# EAGLE design MysensorsDimmer (EAGLE 6.5.0)
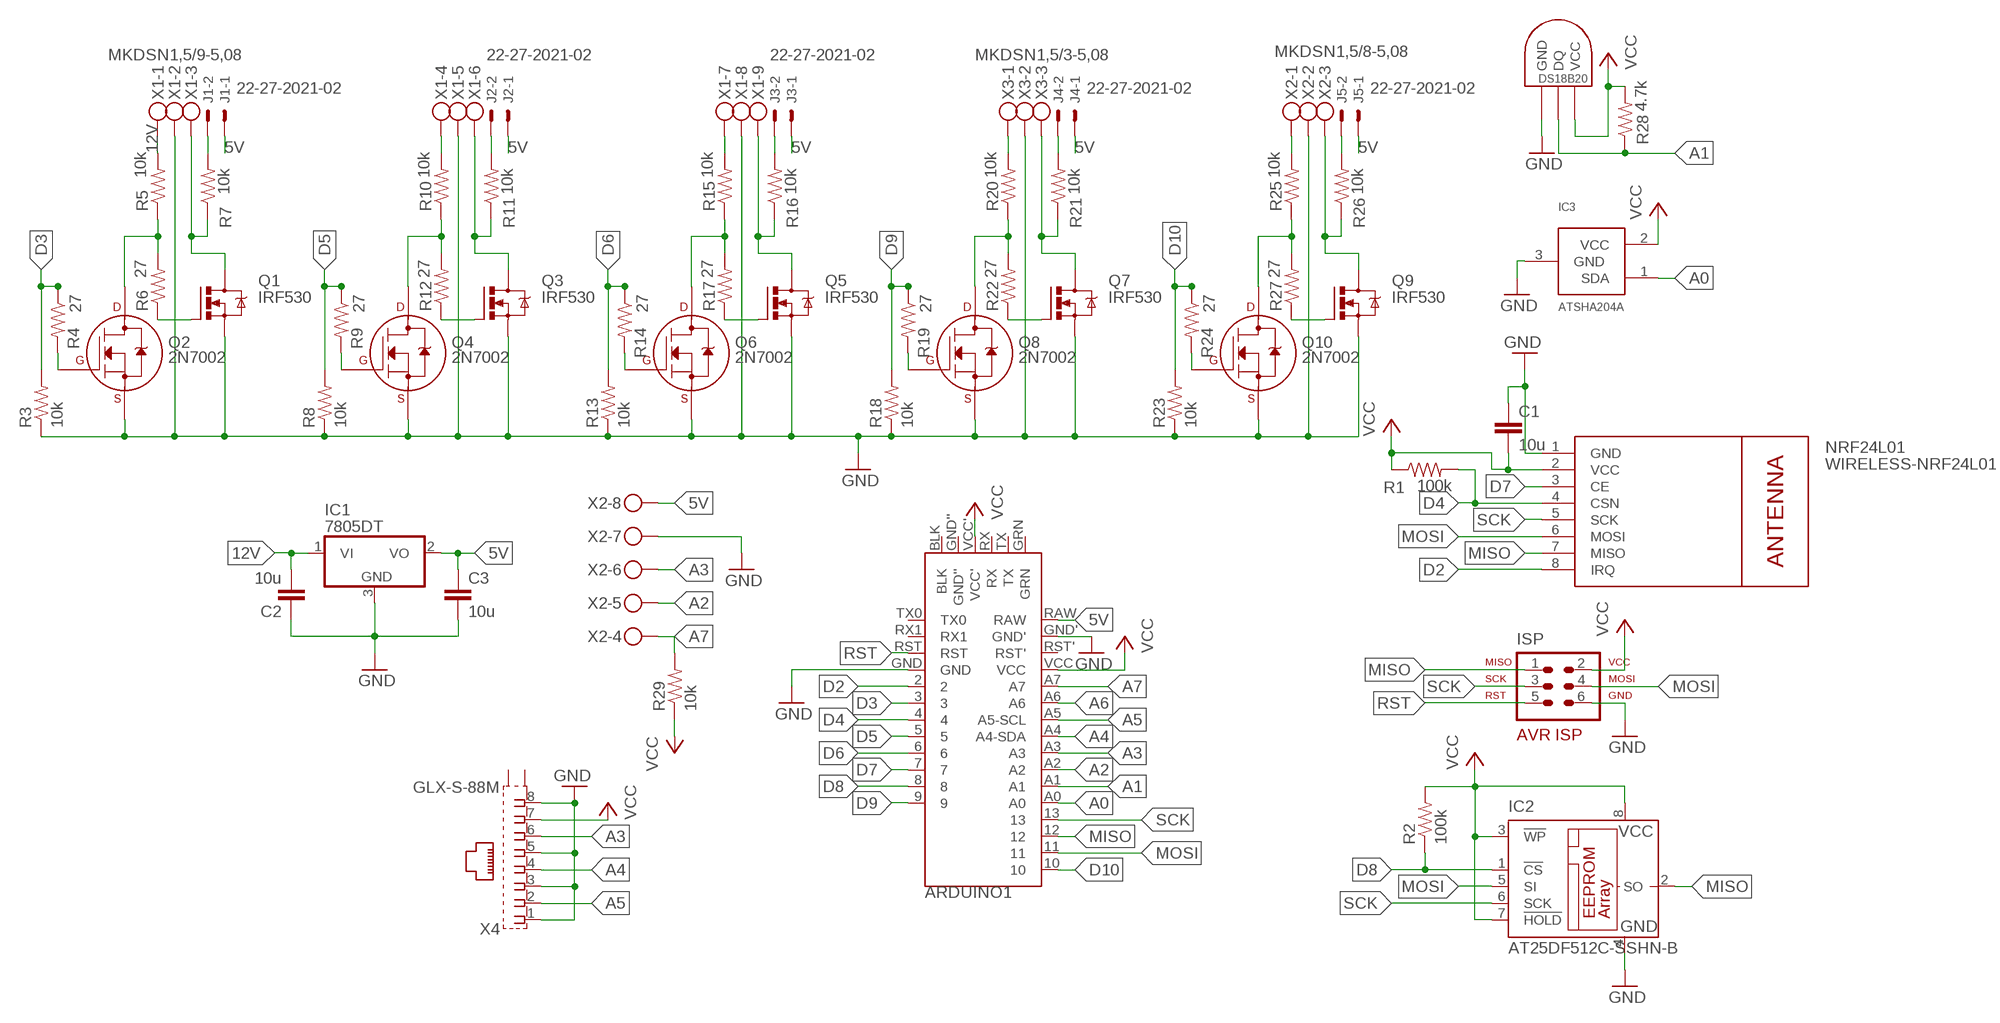
[diagram p0: schematic, sheet 1]

## Parts
ARDUINO1  ARDUINO_PRO_MINI_V1  [ARDUINO_PRO_MINI_V1]
C1  10u  CAP0603-CAP  [0603-CAP]
C2  10u  CAP1206  [1206]
C3  10u  CAP0603-CAP  [0603-CAP]
IC1  7805DT  [TO252]
IC2  AT25DF512C-SSHN-B  25AA080SN  [SO-08]
IC3  ATSHA204A  [SOT23]
IC4  DS1820  [µSOP8]
ISP  N/M  AVR-ISP-6VERT  [AVR-ISP-6]
J1  22-27-2021-02  [6410-02]
J2  22-27-2021-02  [6410-02]
J3  22-27-2021-02  [6410-02]
J4  22-27-2021-02  [6410-02]
J5  22-27-2021-02  [6410-02]
NRF24L01  WIRELESS-NRF24L01  [WIRELESS-NRF24L01]
Q1  IRF530  [TO220BV]
Q2  2N7002  2N7002_SOT23  [SOT-23]
Q3  IRF530  [TO220BV]
Q4  2N7002  2N7002_SOT23  [SOT-23]
Q5  IRF530  [TO220BV]
Q6  2N7002  2N7002_SOT23  [SOT-23]
Q7  IRF530  [TO220BV]
Q8  2N7002  2N7002_SOT23  [SOT-23]
Q9  IRF530  [TO220BV]
Q10  2N7002  2N7002_SOT23  [SOT-23]
R1  100k  RESISTOR0603-RES  [0603-RES]
R2  100k  RESISTOR0603-RES  [0603-RES]
R3  10k  RESISTOR0603-RES  [0603-RES]
R4  27  RESISTOR0603-RES  [0603-RES]
R5  10k  RESISTOR0603-RES  [0603-RES]
R6  27  RESISTOR0603-RES  [0603-RES]
R7  10k  RESISTOR0603-RES  [0603-RES]
R8  10k  RESISTOR0603-RES  [0603-RES]
R9  27  RESISTOR0603-RES  [0603-RES]
R10  10k  RESISTOR0603-RES  [0603-RES]
R11  10k  RESISTOR0603-RES  [0603-RES]
R12  27  RESISTOR0603-RES  [0603-RES]
R13  10k  RESISTOR0603-RES  [0603-RES]
R14  27  RESISTOR0603-RES  [0603-RES]
R15  10k  RESISTOR0603-RES  [0603-RES]
R16  10k  RESISTOR0603-RES  [0603-RES]
R17  27  RESISTOR0603-RES  [0603-RES]
R18  10k  RESISTOR0603-RES  [0603-RES]
R19  27  RESISTOR0603-RES  [0603-RES]
R20  10k  RESISTOR0603-RES  [0603-RES]
R21  10k  RESISTOR0603-RES  [0603-RES]
R22  27  RESISTOR0603-RES  [0603-RES]
R23  10k  RESISTOR0603-RES  [0603-RES]
R24  27  RESISTOR0603-RES  [0603-RES]
R25  10k  RESISTOR0603-RES  [0603-RES]
R26  10k  RESISTOR0603-RES  [0603-RES]
R27  27  RESISTOR0603-RES  [0603-RES]
R28  4.7k  RESISTOR0603-RES  [0603-RES]
R29  10k  RESISTOR0603-RES  [0603-RES]
X1  MKDSN1,5/9-5,08  [MKDSN1,5/9-5,08]
X2  MKDSN1,5/8-5,08  [MKDSN1,5/8-5,08]
X3  MKDSN1,5/3-5,08  [MKDSN1,5/3-5,08]
X4  GLX-S-88M  [GLX-S-88M]

## Nets
5V [Power]: ARDUINO1.RAW C3.1 IC1.2(VO) J1.1 J2.1 J3.1 J4.1 J5.1 X2.8
12V [Power]: C2.2 IC1.1(VI) R5.2 X1.1
A0: ARDUINO1.A0 IC3.1(SDA)
A1: ARDUINO1.A1 IC4.1(DQ) R28.1
A2: ARDUINO1.A2 X2.5
A3: ARDUINO1.A3 X2.6 X4.6
A4: ARDUINO1.A4(A4-SDA) X4.4
A5: ARDUINO1.A5(A5-SCL) X4.2
A6: ARDUINO1.A6
A7: ARDUINO1.A7 R29.2 X2.4
D2: ARDUINO1.2 NRF24L01.8(IRQ)
D3: ARDUINO1.3 R3.2 R4.1
D4: ARDUINO1.4 NRF24L01.4(CSN) R1.2
D5: ARDUINO1.5 R8.2 R9.1
D6: ARDUINO1.6 R13.2 R14.1
D7: ARDUINO1.7 NRF24L01.3(CE)
D8: ARDUINO1.8 IC2.1(!CS) R2.1
D9: ARDUINO1.9 R18.2 R19.1
D10: ARDUINO1.10 R23.2 R24.1
GND [Power]: ARDUINO1.GND ARDUINO1.GND' C1.1 C2.1 C3.2 IC1.3(GND) IC2.4(GND) IC3.3(GND) IC4.4(GND) ISP.6 NRF24L01.1(GND) Q1.S Q2.2(S) Q3.S Q4.2(S) Q5.S Q6.2(S) Q7.S Q8.2(S) Q9.S Q10.2(S) R3.1 R8.1 R13.1 R18.1 R23.1 X1.2 X1.5 X1.8 X2.2 X2.7 X3.2 X4.1 X4.3 X4.5 X4.8
MISO: ARDUINO1.12 IC2.2(SO) ISP.1 NRF24L01.7(MISO)
MOSI: ARDUINO1.11 IC2.5(SI) ISP.4 NRF24L01.6(MOSI)
N$1 [led power]: Q3.D R11.1 X1.6
N$2 [Power]: Q1.G R6.1
N$3: Q4.1(G) R9.2
N$4: Q4.3(D) R10.1 R12.2
N$5: Q2.1(G) R4.2
N$6 [Power]: Q3.G R12.1
N$7: J2.2 R11.2
N$8: Q2.3(D) R5.1 R6.2
N$9: J1.2 R7.2
N$10 [led power]: Q5.D R16.1 X1.9
N$11: Q6.1(G) R14.2
N$12: Q6.3(D) R15.1 R17.2
N$13 [Power]: Q5.G R17.1
N$14: J3.2 R16.2
N$15 [led power]: Q7.D R21.1 X3.3
N$16: Q8.1(G) R19.2
N$17: Q8.3(D) R20.1 R22.2
N$18 [Power]: Q7.G R22.1
N$19: J4.2 R21.2
N$20 [led power]: Q9.D R26.1 X2.3
N$21: Q10.1(G) R24.2
N$22 [led power]: Q1.D R7.1 X1.3
N$23: Q10.3(D) R25.1 R27.2
N$24 [Power]: Q9.G R27.1
N$25: J5.2 R26.2
N$26: R10.2 X1.4
N$27: R15.2 X1.7
N$28: R20.2 X3.1
N$29: R25.2 X2.1
RST: ARDUINO1.RST ISP.5
SCK: ARDUINO1.13 IC2.6(SCK) ISP.3 NRF24L01.5(SCK)
VCC [Power]: ARDUINO1.VCC ARDUINO1.VCC' C1.2 IC2.3(!WP) IC2.7(!HOLD) IC2.8(VCC) IC3.2(VCC) IC4.8(VCC) ISP.2 NRF24L01.2(VCC) R1.1 R2.2 R28.2 R29.1 X4.7
Unconnected: ARDUINO1.BLK ARDUINO1.GND'' ARDUINO1.GRN ARDUINO1.RST' ARDUINO1.RX ARDUINO1.RX1 ARDUINO1.TX ARDUINO1.TX0 X4.S1 X4.S2

## Library data of the parts
ARDUINO1 = Arduino_Pro_Mini:ARDUINO_PRO_MINI_V1
C1-C3 = SparkFun-Passives:CAP: Capacitor Standard 0603 ceramic capacitor, and 0.1" leaded capacitor.
IC1 = linear:78*: Positive VOLTAGE REGULATOR Source: http://cache.national.com/ds/LM/LM78L05.pdf http://www.fairchildsemi.com/ds/LM/LM7805.pdf
IC2 = microchip:25*: Serial EEPROM 4K/ 8K , SPI bus; MF: MICROCHIP; MPN: 25AA080/SN; OC_FARNELL: 1816072; OC_NEWARK: 92C7351
IC3 = Sensor:ATSHA204A
IC4 = Ava:DS1820: DS18B20 Programmable Resolution 1-Wire Digital Thermometer Description The DS18B20 digital thermometer provides 9-bit to 12-bit Celsius temperature measurements and has an alarm function with nonvolatile user-programmable upper and lower trigger points. The DS18B20 communicates over a 1-Wire® bus that by definition requires only one data line (and ground) for communication with a central microprocessor. It has an operating temperature range of -55°C to +125°C and is accurate to ±0.5°C over the range of -10°C to +85°C. In addition, the DS18B20 can derive power directly from the data line ("parasite power"), eliminating the need for an external power supply. Each DS18B20 has a unique 64-bit serial code, which allows multiple DS18B20s to function on the same 1-Wire bus. Thus, it is simple to use one microprocessor to control many DS18B20s distributed over a large area. Applications that can benefit from this feature include HVAC environmental controls, temperature monitoring systems inside buildings, equipment, or machinery, and process monitoring and control systems.
ISP = avr-7:AVR-ISP-6: AVR ISP-6 Serial Programming Header
J1-J5 = con-molex:22-?-02: CONNECTOR wire to board 2.54 mm (.1 inch) pitch header; OC_FARNELL: unknown; OC_NEWARK: unknown
NRF24L01 = diy-modules:WIRELESS-NRF24L01: 2.4 GHz Wireless Module based on NRF24L01 chip More details available here: http://www.electrodragon.com/w/NRF24L01 Click here to find device on ebay.com <http://www.ebay.com/sch/nrf24l01+arduino>
Q1 Q3 Q5 Q7 Q9 = transistor-power:IRF530: HEXFET Power MOSFET
Q2 Q4 Q6 Q8 Q10 = transistors:2N700*: 2N7000, 2N7002, NDS7002A N-channel enhancement mode MOSFET
R1-R29 = SparkFun-Passives:RESISTOR: Resistor Basic schematic elements and footprints for 0603, 1206, and PTH resistors.
X1 = con-phoenix-508:MKDSN1,5/9-5,08: MKDSN 1,5/ 9-5,08 Printklemme Nennstrom: 13,5 A Nennspannung: 250 V Rastermaß: 5,08 mm Polzahl: 9 Anschlussart: Schraubanschluss Montage: Löten Anschlussrichtung Leiter/Platine: 0 ° Artikelnummer: 1729199 Source: http://eshop.phoenixcontact.com .. 1729199.pdf; MPN: SMKDSN1,5/9-5,08; OC_FARNELL: 1792912; OC_NEWARK: 70R0305
X2 = con-phoenix-508:MKDSN1,5/8-5,08: MKDSN 1,5/ 8-5,08 Printklemme Nennstrom: 13,5 A Nennspannung: 250 V Rastermaß: 5,08 mm Polzahl: 8 Anschlussart: Schraubanschluss Montage: Löten Anschlussrichtung Leiter/Platine: 0 ° Artikelnummer: 1729186 Source: http://eshop.phoenixcontact.com .. 1729186.pdf; MPN: SMKDSN1,5/8-5,08; OC_FARNELL: 1792911; OC_NEWARK: 70R0304
X3 = con-phoenix-508:MKDSN1,5/3-5,08: MKDSN 1,5/ 3-5,08 Printklemme Nennstrom: 13,5 A Nennspannung: 250 V Rastermaß: 5,08 mm Polzahl: 3 Anschlussart: Schraubanschluss Montage: Löten Anschlussrichtung Leiter/Platine: 0 ° Artikelnummer: 1729131 Source: http://eshop.phoenixcontact.com .. 1729131.pdf; MPN: SMKDSN1,5/3-5,08; OC_FARNELL: 1792904; OC_NEWARK: 70R0299
X4 = con-kycon:GLX-S-88M: Mod. Jack, Right Angle, 8 posiotion, 8 contatcs RJ45 Source: GLX-S-88M.pdf; OC_FARNELL: unknown; OC_NEWARK: unknown

## Net classes
0 default: width 0.203 mm, drill 0.406 mm, clearance 0.203 mm
1 Power: width 0.406 mm, drill 0.406 mm, clearance 0.203 mm
2 led power: width 1.524 mm, drill 0.406 mm, clearance 0.203 mm

## Board
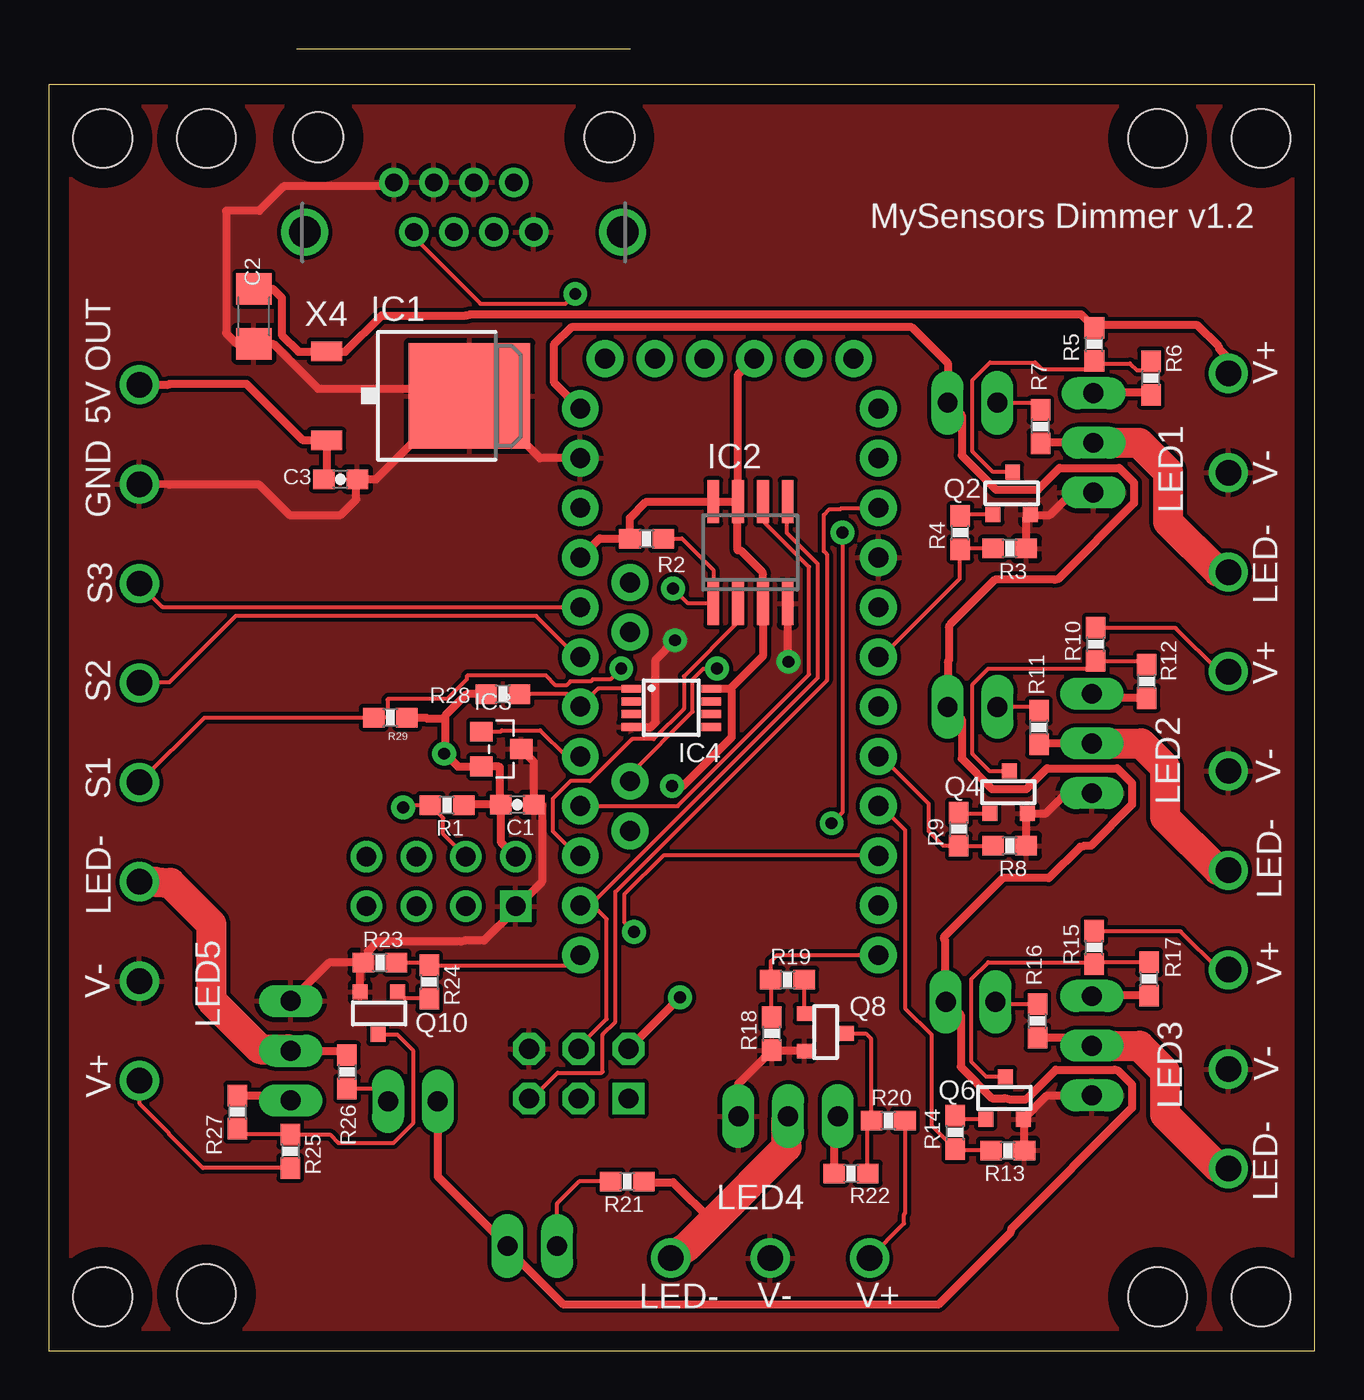
[diagram p1: board, top side]
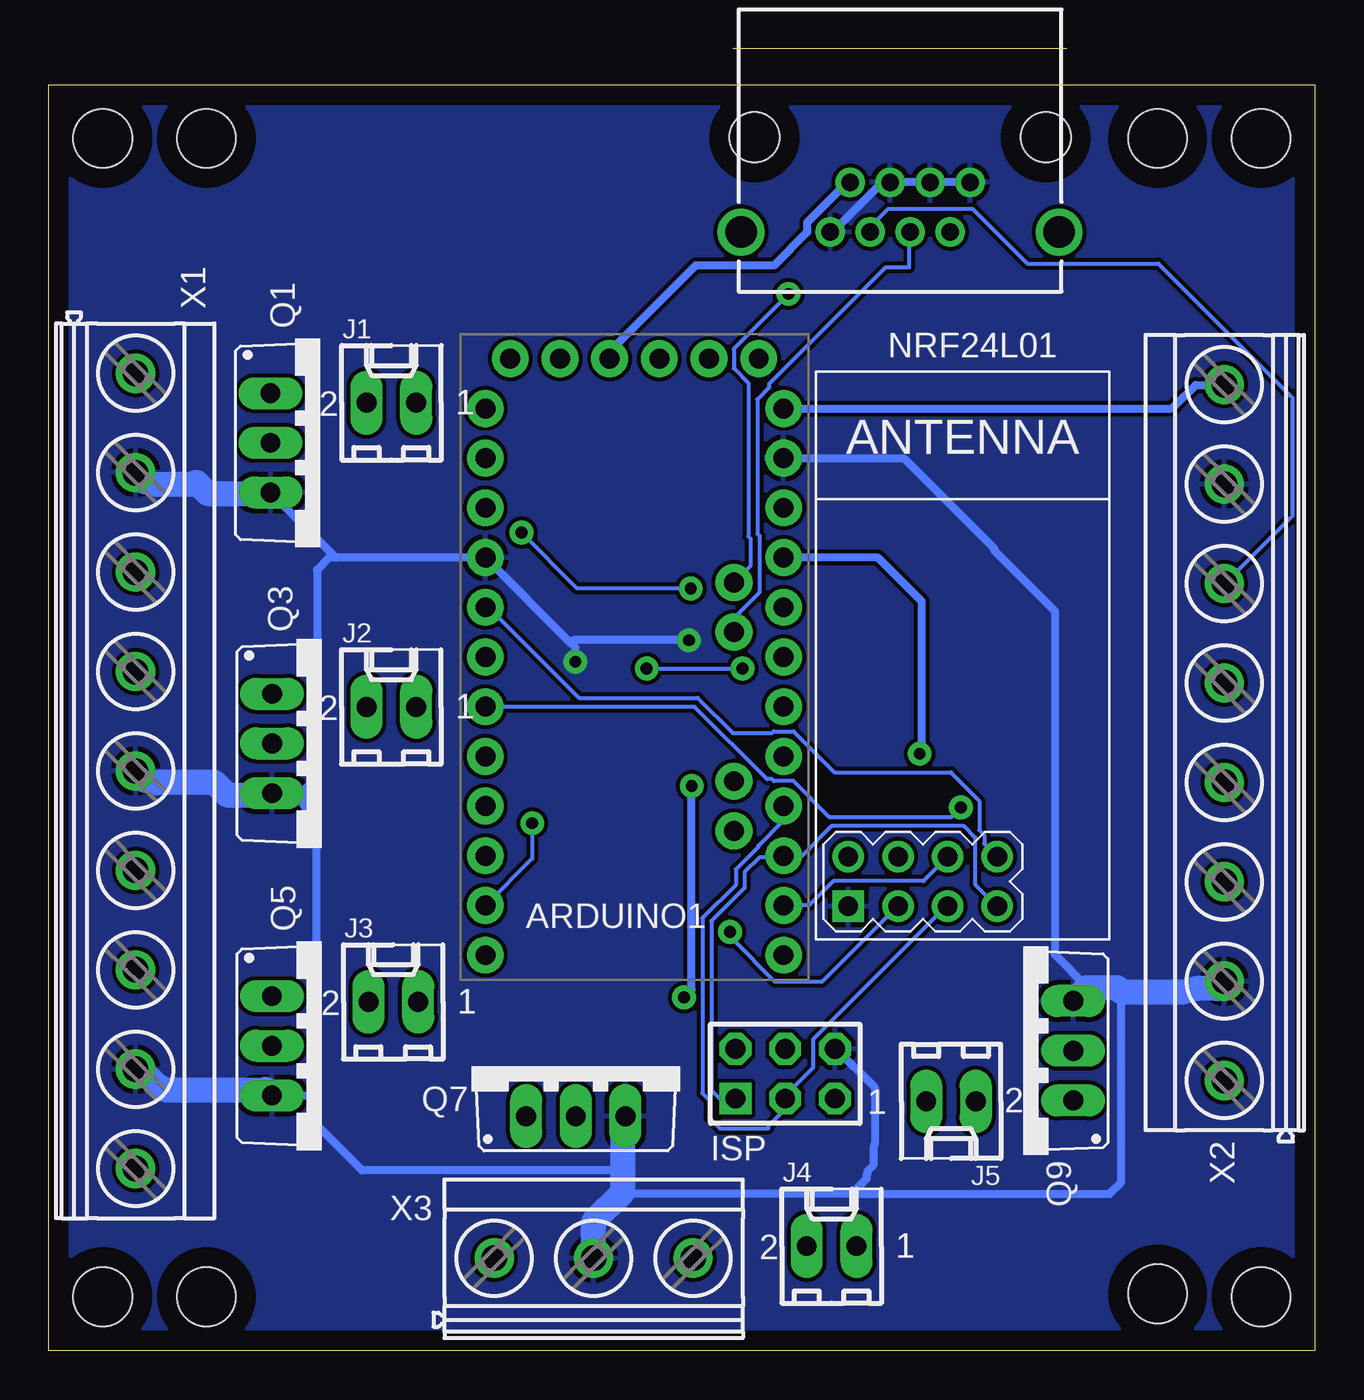
[diagram p2: board, bottom side, seen from below]

Size 64.7 x 64.7 mm. Coordinates in mm from the lower left corner, seen from the top.
Outline: 0,0 64.7,0 64.7,64.7 0,64.7 0,0
Copper layers (1*16): Top 0.035mm / dielectric 1.5mm / Bottom 0.035mm
Design rules "default *": minimum track width 8mil, minimum drill 24mil, track to track 8mil, track to pad 8mil, pad to pad 8mil, via to via 8mil, smd to smd 8mil, copper to edge 40mil, drill to drill 8mil, minimum pad ring 12mil, minimum via ring 12mil, stop-mask expansion 4mil, vias tented up to drill 0mil, thermal gap 10mil
Holes 3 mm at 2.75,2.75 61.95,2.75 2.75,61.95 61.95,61.95 8.05,61.95 8.05,2.9 56.65,2.75 56.65,61.95

### Footprints (pad centres in the part's own frame; a part is rotated, then mirrored left to right if it is on the bottom)
ARDUINO_PRO_MINI_V1 = drill 1.016 pad 1.88: 2 -7.62,2.54; 3 -7.62,0; 4 -7.62,-2.54; 5 -7.62,-5.08; 6 -7.62,-7.62; 7 -7.62,-10.16; 8 -7.62,-12.7; 9 -7.62,-15.24; 10 7.62,-15.24; 11 7.62,-12.7; 12 7.62,-10.16; 13 7.62,-7.62; A0 7.62,-5.08; A1 7.62,-2.54; A2 7.62,0; A3 7.62,2.54; A4 5.08,1.27; A5 5.08,3.81; A6 5.08,-8.89; A7 5.08,-6.35; BLK -6.35,15.24; GND -7.62,5.08; GND' 7.62,10.16; GND'' -3.81,15.24; GRN 6.35,15.24; RAW 7.62,12.7; RST -7.62,7.62; RST' 7.62,7.62; RX 1.27,15.24; RX1 -7.62,10.16; TX 3.81,15.24; TX0 -7.62,12.7; VCC 7.62,5.08; VCC' -1.27,15.24
0603-CAP = smd 1.1 x 1: 1 -0.85,0; 2 0.85,0
1206 = smd 1.6 x 1.8: 1 -1.4,0; 2 1.4,0
TO252 = smd 1 x 1.6: 1 -2.28,-4.8; 2 2.28,-4.8 | smd 5.4 x 6.2: 3 0,2.5
SO-08 = smd 0.6 x 2.2: 1 -1.905,-2.6; 2 -0.635,-2.6; 3 0.635,-2.6; 4 1.905,-2.6; 5 1.905,2.6; 6 0.635,2.6; 7 -0.635,2.6; 8 -1.905,2.6
SOT23 = smd 1.016 x 1.143: 1 -0.889,-1.016; 2 0.889,-1.016; 3 0,1.016
µSOP8 = smd 0.4 x 1: 1 -0.975,-2.05; 2 -0.325,-2.05; 3 0.325,-2.05; 4 0.975,-2.05; 5 0.975,2.05; 6 0.325,2.05; 7 -0.325,2.05; 8 -0.975,2.05
AVR-ISP-6 = drill 1.016 square: 1 -2.54,-1.27 | drill 1.016 octagon: 2 -2.54,1.27; 3 0,-1.27; 4 0,1.27; 5 2.54,-1.27; 6 2.54,1.27
6410-02 = drill 1.016 long: 1 1.27,0; 2 -1.27,0
WIRELESS-NRF24L01 = drill 1 square: 1 -12.7,6.35 | drill 1: 2 -10.16,6.35; 3 -12.7,3.81; 4 -10.16,3.81; 5 -12.7,1.27; 6 -10.16,1.27; 7 -12.7,-1.27; 8 -10.16,-1.27
TO220BV = drill 1.016 long: D 0,-2.54; G -2.54,-2.54; S 2.54,-2.54
SOT-23 = smd 0.762 x 0.762: 1 -0.979,-1.101; 2 0.94,-1.101; 3 0.025,1.067
0603-RES = smd 1.1 x 1: 1 -0.85,0; 2 0.85,0
MKDSN1,5/9-5,08 = drill 1.3 pad 2: 1 -20.341,0.025; 2 -15.261,0.025; 3 -10.181,0.025; 4 -5.101,0.025; 5 -0.021,0.025; 6 5.059,0.025; 7 10.139,0.025; 8 15.219,0.025; 9 20.299,0.025
MKDSN1,5/8-5,08 = drill 1.3 pad 2: 1 -17.801,0.025; 2 -12.721,0.025; 3 -7.641,0.025; 4 -2.561,0.025; 5 2.519,0.025; 6 7.599,0.025; 7 12.679,0.025; 8 17.759,0.025
MKDSN1,5/3-5,08 = drill 1.3 pad 2: 1 -7.641,0.025; 2 -2.561,0.025; 3 2.519,0.025
GLX-S-88M = drill 0.9 pad 1.422: 1 -3.57,-2.3; 2 -2.55,-4.84; 3 -1.53,-2.3; 4 -0.51,-4.84; 5 0.51,-2.3; 6 1.53,-4.84; 7 2.55,-2.3; 8 3.57,-4.84 | drill 1.6 pad 2.184: S1 -8.125,-4.84; S2 8.125,-4.84 | hole 2.55: -7.44,0; 7.44,0

### Placement (x,y rotation side)
ARDUINO1  34.77,35.45 0 bottom
C1  23.94,27.9 180 top
C2  10.47,52.85 90 top
C3  14.9,44.53 0 top
IC1  18.99,48.79 270 top
IC2  35.85,40.79 0 top
IC3  23.12,30.74 270 top
IC4  31.8,32.85 270 top
ISP  27.07,14.15 0 bottom
J1  47.2,48.44 0 bottom
J2  47.2,32.9 0 bottom
J3  47.1,17.82 0 bottom
J4  24.7,5.34 0 bottom
J5  18.6,12.74 180 bottom
NRF24L01  17.5,35.4 90 bottom
Q1  50.84,46.39 270 bottom
Q2  49.22,43.82 0 top
Q3  50.76,31.03 270 bottom
Q4  49.06,28.55 0 top
Q5  50.76,15.57 270 bottom
Q6  48.86,12.92 0 top
Q7  37.77,14.52 0 bottom
Q8  39.7,16.24 270 top
Q9  14.89,15.33 90 bottom
Q10  16.84,17.22 180 top
R1  20.35,27.87 180 top
R2  30.55,41.49 180 top
R3  49.1,40.99 180 top
R4  46.57,41.8 90 top
R5  53.43,51.42 90 top
R6  56.32,49.7 90 top
R7  50.67,47.22 90 top
R8  49.1,25.8 180 top
R9  46.5,26.65 90 top
R10  53.5,36.1 90 top
R11  50.6,31.84 90 top
R12  56.1,34.19 90 top
R13  49,10.22 180 top
R14  46.32,11.15 90 top
R15  53.42,20.6 90 top
R16  50.52,16.84 90 top
R17  56.22,18.99 90 top
R18  36.94,16.2 90 top
R19  37.75,18.96 0 top
R20  42.9,11.76 0 top
R21  29.56,8.64 180 top
R22  40.99,9.06 0 top
R23  16.92,19.83 0 top
R24  19.43,18.84 270 top
R25  12.33,10.19 270 top
R26  15.23,14.24 270 top
R27  9.63,12.19 270 top
R28  23.2,33.55 180 top
R29  17.45,32.35 180 top
X1  60.3,29.6 270 bottom
X2  4.6,31.6 90 bottom
X3  34.3,4.7 0 bottom
X4  21.2,62 0 top

### Tracks (layer width: path | path; a pad name or v marks a point on that pad's centre or on a via)
5V
  Top 0.406: C3.1 14.19,44.67 IC1.2 12.99,46.51 10.1,49.4 6.17,49.4 6,49.35 4.65,49.35 X2.8 | ARDUINO1.RAW 25.8,49.5 25.8,51.4 26.7,52.3 44.1,52.3 45.93,50.47 J1.1 46.1,48.35 46.65,47.8 46.65,45.75 48.4,44 50.55,44 51.65,45.1 54.7,45.1 55.45,44.35 55.45,43.3 51.6,39.45 51.4,39.4 48.35,39.4 46.05,37.1 46,36.9 46,35.3 45.95,35.1 45.95,33.05 J2.1 46.1,32.8 46.65,32.25 46.65,30.25 48.2,28.7 49.95,28.7 51,29.75 54.6,29.75 55.35,29 55.35,27.9 53.25,25.8 52.9,25.8 52.7,25.75 51.1,24.15 48.75,24.15 45.75,21.15 45.8,20.95 45.8,18 J3.1 46,17.75 46.6,17.15 46.6,14.5 48.2,12.9 48.85,12.9 49.05,12.85 49.95,12.85 51.45,14.35 54.45,14.35 54.65,14.3 55.35,13.6 55.35,12.4 49.2,6.25 49.15,6.05 45.45,2.35 26.3,2.35 23.5,5.15 J4.1 19.87,8.9 J5.1
  Bottom 0.406: ARDUINO1.RAW 7.31,48.15 7.31,48.18 7.15,48.3 6.1,49.35 4.65,49.35 X2.8
12V
  Top 0.406: X1.1 60.25,49.95 60.25,50.75 59.85,51.15 59.77,51.33 58.7,52.4 53.55,52.4 R5.2 52.75,52.95 21.5,52.95 21.3,52.9 17,52.9 15.15,51.05 14.4,51.05 IC1.1 14.15,51.05 12.75,51.05 11.9,51.9 11.9,53.8 11.45,54.25 10.5,54.25 C2.2
A0
  Top 0.203: ARDUINO1.A0 27.15,30.4 26.4,30.4 25.1,31.7 23.15,31.7 23.1,31.65 22.15,31.65 IC3.1
A1
  Top 0.203: IC4.1 28.07,33.83 ARDUINO1.A1 27.1,32.95 26.5,33.55 R28.1
A2
  Top 0.203: ARDUINO1.A2 27,35.45 24.9,37.55 9.55,37.55 6.15,34.15 4.65,34.15 X2.5
A3
  Top 0.203: ARDUINO1.A3 5.8,38 4.65,39.15 X2.6
  Bottom 0.203: X2.6 4.6,39.2 1.15,42.65 1.15,48.7 8,55.55 14.7,55.55 17.5,58.35 21.8,58.35 22.7,57.45 22.7,57.2 X4.6
A4
  Bottom 0.203: ARDUINO1.A4 29.65,36.75 29.65,37.5 28.4,38.75 28.4,41.65 28.5,41.75 28.5,48.6 27.9,49.2 27.9,49.4 21.95,55.35 20.75,55.35 20.75,57.1 X4.4
A5  (via drill 0.61)
  Top 0.203: v26.9,54 26.4,53.5 22.05,53.5 18.65,56.9 X4.2
  Bottom 0.203: ARDUINO1.A5 28.85,40.1 28.85,41.5 28.95,41.6 28.95,49.45 29.7,50.2 29.7,51.2 v26.9,54
A7  (via drill 0.61)
  Top 0.203: X2.4 4.65,29.05 7.95,32.35 R29.2 17.3,32.35 17.3,33.25 17.35,33.3 20.35,33.3 21.35,34.3 21.35,34.45 21.4,34.5 25.4,34.5 25.9,34 26.45,34 26.65,34.2 27.7,34.2 27.8,34.3 28.7,34.3 v29.25,34.85 | v34.15,34.85 33.45,34.85 32.9,34.3 32.9,32.65 29.7,29.45 ARDUINO1.A7
  Bottom 0.203: v34.15,34.85 v29.25,34.85
D2
  Bottom 0.203: NRF24L01.8 16.25,25.25 16.9,25.9 16.9,26.35 17.15,26.6 17.15,28.1 18.6,29.55 24.55,29.55 26.65,31.65 27.65,31.65 27.75,31.55 29.75,31.55 31.55,33.35 37.6,33.35 42.2,37.95 42.35,37.95 ARDUINO1.2
D3
  Top 0.203: R3.2 46.61,40.99 | R4.1 46.55,40.85 46.55,39.45 42.55,35.45 ARDUINO1.3
  Top 0.254: 46.61,40.99 R4.1
D4  (via drill 0.61)
  Top 0.203: NRF24L01.4 20.15,26.4 20.15,27.22 R1.2 19.4,27.85 18.5,27.85 18.4,27.75 v18.1,27.75
  Bottom 0.203: v18.1,27.75 18.6,27.25 24.8,27.25 26.65,29.1 27.65,29.1 27.75,29.2 28,29.2 31.7,32.9 42.35,32.9 ARDUINO1.4
D5
  Top 0.203: ARDUINO1.5 42.4,30.35 42.55,30.35 44.95,27.95 44.95,26.55 45.7,25.8 R9.1 46.6,25.8 R8.2
D6
  Top 0.203: R13.2 46.4,10.22 R14.1 46.3,10.3 45.1,11.5 45.1,16.15 43.75,17.5 43.75,26.6 42.55,27.8 42.4,27.8 ARDUINO1.6
D7  (via drill 0.61)
  Top 0.203: ARDUINO1.7 42.35,25.3 31.4,25.3 29.4,23.3 29.4,21.9 v29.9,21.4
  Bottom 0.203: NRF24L01.3 21.35,22.7 25.2,18.85 27.6,18.85 29.75,21 29.75,21.35 29.85,21.35 v29.9,21.4
D8  (via drill 0.61)
  Top 0.203: R2.1 32.35,41.5 33.95,39.9 IC2.1 32.66,38.19 v31.9,38.95 | v40.55,41.8 40.55,27.5 v40,26.95
  Bottom 0.203: v31.9,38.95 37.7,38.95 v40.55,41.8 | v40,26.95 40,25.14 ARDUINO1.8
D9
  Top 0.203: ARDUINO1.9 42.35,20.2 37.2,20.2 36.9,19.9 R19.1 36.9,17.1 R18.2
D10
  Top 0.203: R23.2 19.29,19.83 R24.1 26.63,19.69 ARDUINO1.10
GND  (via drill 0.61)
  Top 0.406: 20.9,49.22 20.7,49.22 20.5,49.02 20.5,48.3 16.73,44.53 C3.2 15.7,44.48 15.7,43.5 14.9,42.7 12.3,42.7 10.74,44.26 6.15,44.26 X2.7 | 20.9,49.22 21.06,49.22 IC1.3 21.88,48.4 22.3,48.4 25.09,45.61 ARDUINO1.GND' | R13.1 49.85,11.77 Q6.2 51.01,13.03 Q5.S | Q8.2 38.55,15.35 R18.1 35.23,13.64 Q7.S | Q10.2 15.9,19.67 R23.1 | R23.1 14.32,19.83 Q9.S | IC3.3 24.79,30.08 C1.1 24.95,27.9 25.2,27.9 25.2,23.95 23.95,22.7 NRF24L01.1 23.8,22.65 23.8,22.5 22.25,20.95 21.25,20.95 21.05,20.9 16.8,20.9 16.3,20.4 16.3,20.07 R23.1 | IC2.4 37.76,35.24 v37.8,35.2 | v32,36.3 31,35.3 31,32.1 30.77,31.88 IC4.4 | Q1.S 52.3,43.85 51.15,42.7 50.2,42.7 Q2.2 49.95,42.51 R3.1 | R8.1 49.95,27.4 Q4.2 50.2,27.45 50.95,27.45 51.95,28.45 53.3,28.45 Q3.S | 20.9,49.22 20.83,49.15 13.75,49.15 11.45,51.45 10.5,51.45 C2.1 10.3,51.45 9.6,51.45 9.05,52 9.05,58.25 10.75,58.25 12,59.5 17.4,59.5 17.6,59.7 X4.1
  Bottom 0.406: 50.06,40.53 ARDUINO1.GND 38.03,36.17 | 50.06,40.53 Q1.S | 50.06,40.53 50.37,40.53 51,39.9 51,29.29 51.8,28.49 | 51.8,28.49 Q3.S | 51.8,28.49 51.7,28.39 51.7,27.9 51.01,27.21 51.01,13.03 51.1,13.03 | Q5.S 51.1,13.03 | Q7.S 35.23,9.37 35.4,9.2 48.7,9.2 51,11.5 51,12.93 51.1,13.03 | 23.7,8 22.9,8.8 22.9,9 22.85,9.2 22.55,9.5 22.55,10.35 22.5,10.55 22.5,13.45 24.5,15.45 ISP.6 | 23.7,8 35.26,8 35.36,8.1 | 23.7,8 10.5,8 9.9,8.6 9.9,18.34 10.1,18.54 | ARDUINO1.GND' 21.01,45.61 16.4,41 16.4,40.9 13.3,37.8 13.3,20.24 11.6,18.54 | v37.8,35.2 37.8,35.93 38.03,36.17 | v32,36.3 37.9,36.3 38.03,36.17 | X4.1 X4.3 X4.5 21.9,59.65 22.15,59.65 24.6,57.2 24.75,57.2 X4.8
  Bottom 1.27: Q1.S 53.43,43.8 56.6,43.8 57.16,44.36 57.26,44.26 59.17,44.26 59.8,44.4 60.25,44.85 X1.2 | Q3.S 53.39,28.4 55.6,28.4 56.22,29.02 59.17,29.02 59.8,29.15 60.25,29.6 X1.5 | 53.63,13.36 53.57,13.3 | Q7.S 35.36,11.85 35.36,8.1 36.86,6.6 X3.2 | 10.1,18.54 11.6,18.54 11.68,18.54 Q9.S | 53.57,13.3 Q5.S | 9.9,18.34 6.67,18.34 6.05,18.5 5,18.5 4.65,18.85 X2.2 | 53.57,13.3 58.69,13.3 59.25,13.6 60,14.35 60.25,14.35 X1.8
  pour Bottom: 0,0 64.7,0 64.7,64.7 0,64.7
  pour Top: 0,0 64.7,0 64.7,64.7 0,64.7
MISO
  Top 0.203: IC2.2 35.2,38.15 35.2,37.2 32.45,34.45 32.45,32.8 30.9,31.25 29.8,31.25 27.65,29.1 26.65,29.1 25.75,28.2 25.75,26.55 27,25.3 ARDUINO1.12
  Bottom 0.203: NRF24L01.7 16.25,22.7 17.35,23.8 17.35,26.2 17.95,26.8 24.7,26.8 26.2,25.3 27.05,25.3 ARDUINO1.12 27.2,25.2 28.4,25.2 29.15,24.45 29.15,23.65 30.85,21.95 30.85,13.3 30.43,12.88 ISP.1
MOSI
  Top 0.203: 27.65,22.75 27.2,22.75 ARDUINO1.11 | 27.65,22.75 39.3,34.4 39.3,40.2 37.7,41.8 37.7,42.35 37.75,42.4 37.75,43.35 IC2.5 | 27.1,15.45 ISP.4 27.1,15.55 28.5,16.95 28.5,22.05 27.8,22.75 27.65,22.75
  Bottom 0.203: ARDUINO1.11 25.85,22.75 24.6,24 20,24 18.8,25.2 NRF24L01.6
N$1
  Top 0.406: Q3.D 50.63,31.03 R11.1
  Top 1.524: Q3.D 55.82,31.03 57.05,29.8 57.05,27.25 59.75,24.55 60.25,24.55 X1.6
N$2
  Top 0.406: Q1.G 53.4,48.95 56.3,48.95 56.35,48.9 R6.1
N$3
  Top 0.203: 46.55,27.45 Q4.1
  Top 0.254: 46.55,27.45 R9.2
N$4
  Top 0.203: Q4.3 49.05,29.6 48.1,29.6 47.2,30.5 47.2,34.05 48,34.85 53.1,34.85 R10.1 55.9,35.25 R12.2
N$5
  Top 0.203: Q2.1 46.64,42.72 R4.2
N$6
  Top 0.406: R12.1 53.52,33.34 Q3.G
N$7
  Top 0.203: R11.2 50.6,32.9 48.5,32.9 J2.2
N$8
  Top 0.203: Q2.3 49.2,44.9 48.25,44.9 47.2,45.95 47.2,49.6 48.1,50.5 50.4,50.5 50.75,50.15 53.45,50.15 53.45,50.55 R5.1 53.55,50.45 55.25,50.45 55.6,50.1 56.3,50.1 56.3,50.55 R6.2
N$9
  Top 0.203: J1.2 50.31,48.44 R7.2
N$10
  Top 0.406: R16.1 52.88,15.99 Q5.D
  Top 1.524: Q5.D 55.73,15.57 57.05,14.25 57.05,12.05 59.75,9.35 60.3,9.3 X1.9
N$11
  Top 0.203: Q6.1 46.5,11.82
  Top 0.254: 46.5,11.82 R14.2
N$12
  Top 0.203: R17.2 53.52,19.84 R15.1 53.32,19.85 48,19.85 47.15,19 47.15,14.75 47.9,14 48.85,14 Q6.3
N$13
  Top 0.406: R17.1 53.33,18.14 Q5.G
N$14
  Top 0.203: R16.2 48.5,17.69 J3.2
N$15
  Top 0.406: 33.9,6.6 31.9,8.6 30.5,8.6 R21.1
  Top 1.524: Q7.D 37.7,11.9 37.7,10.4 33.9,6.6 32.6,5.3 31.95,4.9 31.8,4.75 X3.3
N$16
  Top 0.203: R19.2 Q8.1
N$17
  Top 0.203: Q8.3 40.8,16.2 41.75,16.2 42,15.95 42,11.8 R20.1 | R22.2 41.84,11.55
  Top 0.254: 41.84,11.55 R20.1
N$18
  Top 0.406: R22.1 40.14,11.8 Q7.G
N$19
  Top 0.203: J4.2 25.97,7.52 27.09,8.64 R21.2
N$20
  Top 0.406: Q9.D 15,15.33 R26.1
  Top 1.524: Q9.D 12.2,15.4 10.8,15.4 8.3,17.9 8.3,21.8 6.2,23.9 5.45,23.95 4.65,23.95 X2.3
N$21
  Top 0.203: R24.2 18.16,17.99 Q10.1
N$22
  Top 0.406: Q1.D 50.69,46.39 R7.1
  Top 1.524: Q1.D 53.55,46.4 55.7,46.4 57.2,44.9 57.2,42.35 59.75,39.8 60.3,39.8 X1.3
N$23
  Top 0.203: R27.2 9.94,11.04 R25.1 14.36,11.04 14.8,10.6 17.6,10.6 18.6,11.6 18.6,15.35 17.8,16.15 16.85,16.15 Q10.3
N$24
  Top 0.406: R27.1 12.1,13.04 Q9.G
N$25
  Top 0.203: R26.2 16.68,13.39 J5.2
N$26
  Top 0.203: R10.2 57.53,36.95 57.6,36.9 59.75,34.75 60.25,34.75 X1.4
N$27
  Top 0.203: R15.2 57.79,21.45 57.85,21.4 59.75,19.5 60.25,19.5 X1.7
N$28
  Top 0.203: R20.2 43.75,7.03 43.7,6.95 43.7,6.5 41.95,4.75 X3.1
N$29
  Top 0.203: R25.2 7.86,9.34 6.12,11.07 6.1,11.15 4.65,12.6 4.65,13.75 X2.1
RST
  Top 0.203: ISP.5 24.55,12.9 24.7,12.9 26,14.2 28.25,14.2 28.3,14.25 28.3,16.15 28.95,16.8 28.95,23.45 39.75,34.25 39.75,40.7 39.6,40.85 39.6,42.7 39.9,43 40.45,43 40.5,43.05 42.35,43.05 ARDUINO1.RST
SCK
  Top 0.203: ARDUINO1.13 32.13,27.83 38.85,34.55 38.85,40.05 36.5,42.4 36.5,43.35 IC2.6
  Bottom 0.203: ARDUINO1.13 27.2,27.8 27.2,27.05 28.45,25.8 28.45,25.75 29.6,24.6 29.6,23.8 31.3,22.1 31.3,13.15 30.95,12.8 30.95,11.9 30.4,11.35 27.95,11.35 27.95,11.45 27.1,12.3 27.1,12.85 ISP.3 27.05,12.95 27.05,13.05 25.65,14.45 25.65,15.9 18.85,22.7 NRF24L01.5
VCC  (via drill 0.61)
  Top 0.406: IC2.7 IC2.8 33.75,43.35 30.5,43.35 29.7,42.55 R2.2 29.5,41.5 28.15,41.5 27.2,40.55 ARDUINO1.VCC | IC2.7 35.2,43.37 35.2,40.9 35.4,40.85 36.45,39.8 36.48,39.62 IC2.3 36.48,35.48 34.88,33.88 34.88,33.83 | C1.2 23.09,26 NRF24L01.2 | C1.2 21.23,27.9 R1.1 | v20.2,30.5 20.2,30.4 | v20.2,30.5 20.4,30.35 20.9,29.85 IC3.2 22.3,29.85 23,29.85 23.05,29.8 23.05,28.1 C1.2 | IC4.8 34.88,33.83 | v31.85,28.85 32.4,28.85 34.9,31.35 34.9,33.65 34.88,33.83 | v32.25,18.05 29.65,15.45 ISP.2 | 20.25,32.3 20.25,32.45 21.35,33.55 R28.2 | 20.25,32.3 20.25,30.7 v20.2,30.5 | IC2.7 35.2,43.55 35.2,49.85 36,50.65 ARDUINO1.VCC' | 20.25,32.3 19.35,32.3 19.3,32.35 R29.1
  Bottom 0.406: v20.2,30.5 20.1,30.6 20.1,38.3 22.33,40.53 ARDUINO1.VCC | v31.85,28.85 31.85,18.45 v32.25,18.05 | X4.7 23.9,59.7 25.95,57.65 25.95,57.15 27.65,55.45 31.65,55.45 36,51.1 36,50.7 ARDUINO1.VCC'

### Text on the board
tPlace: MySensors Dimmer v1.2 | V+ | 5V OUT | LED1 | V- | GND | S3 | LED- | V+ | S2 | LED2 | V- | S1 | LED- | LED- | V- | V+ | LED3 | LED5 | V+ | V- | LED- | LED4 | LED- | V- | V+